# EAGLE design ir_smd (EAGLE 9.6.2)
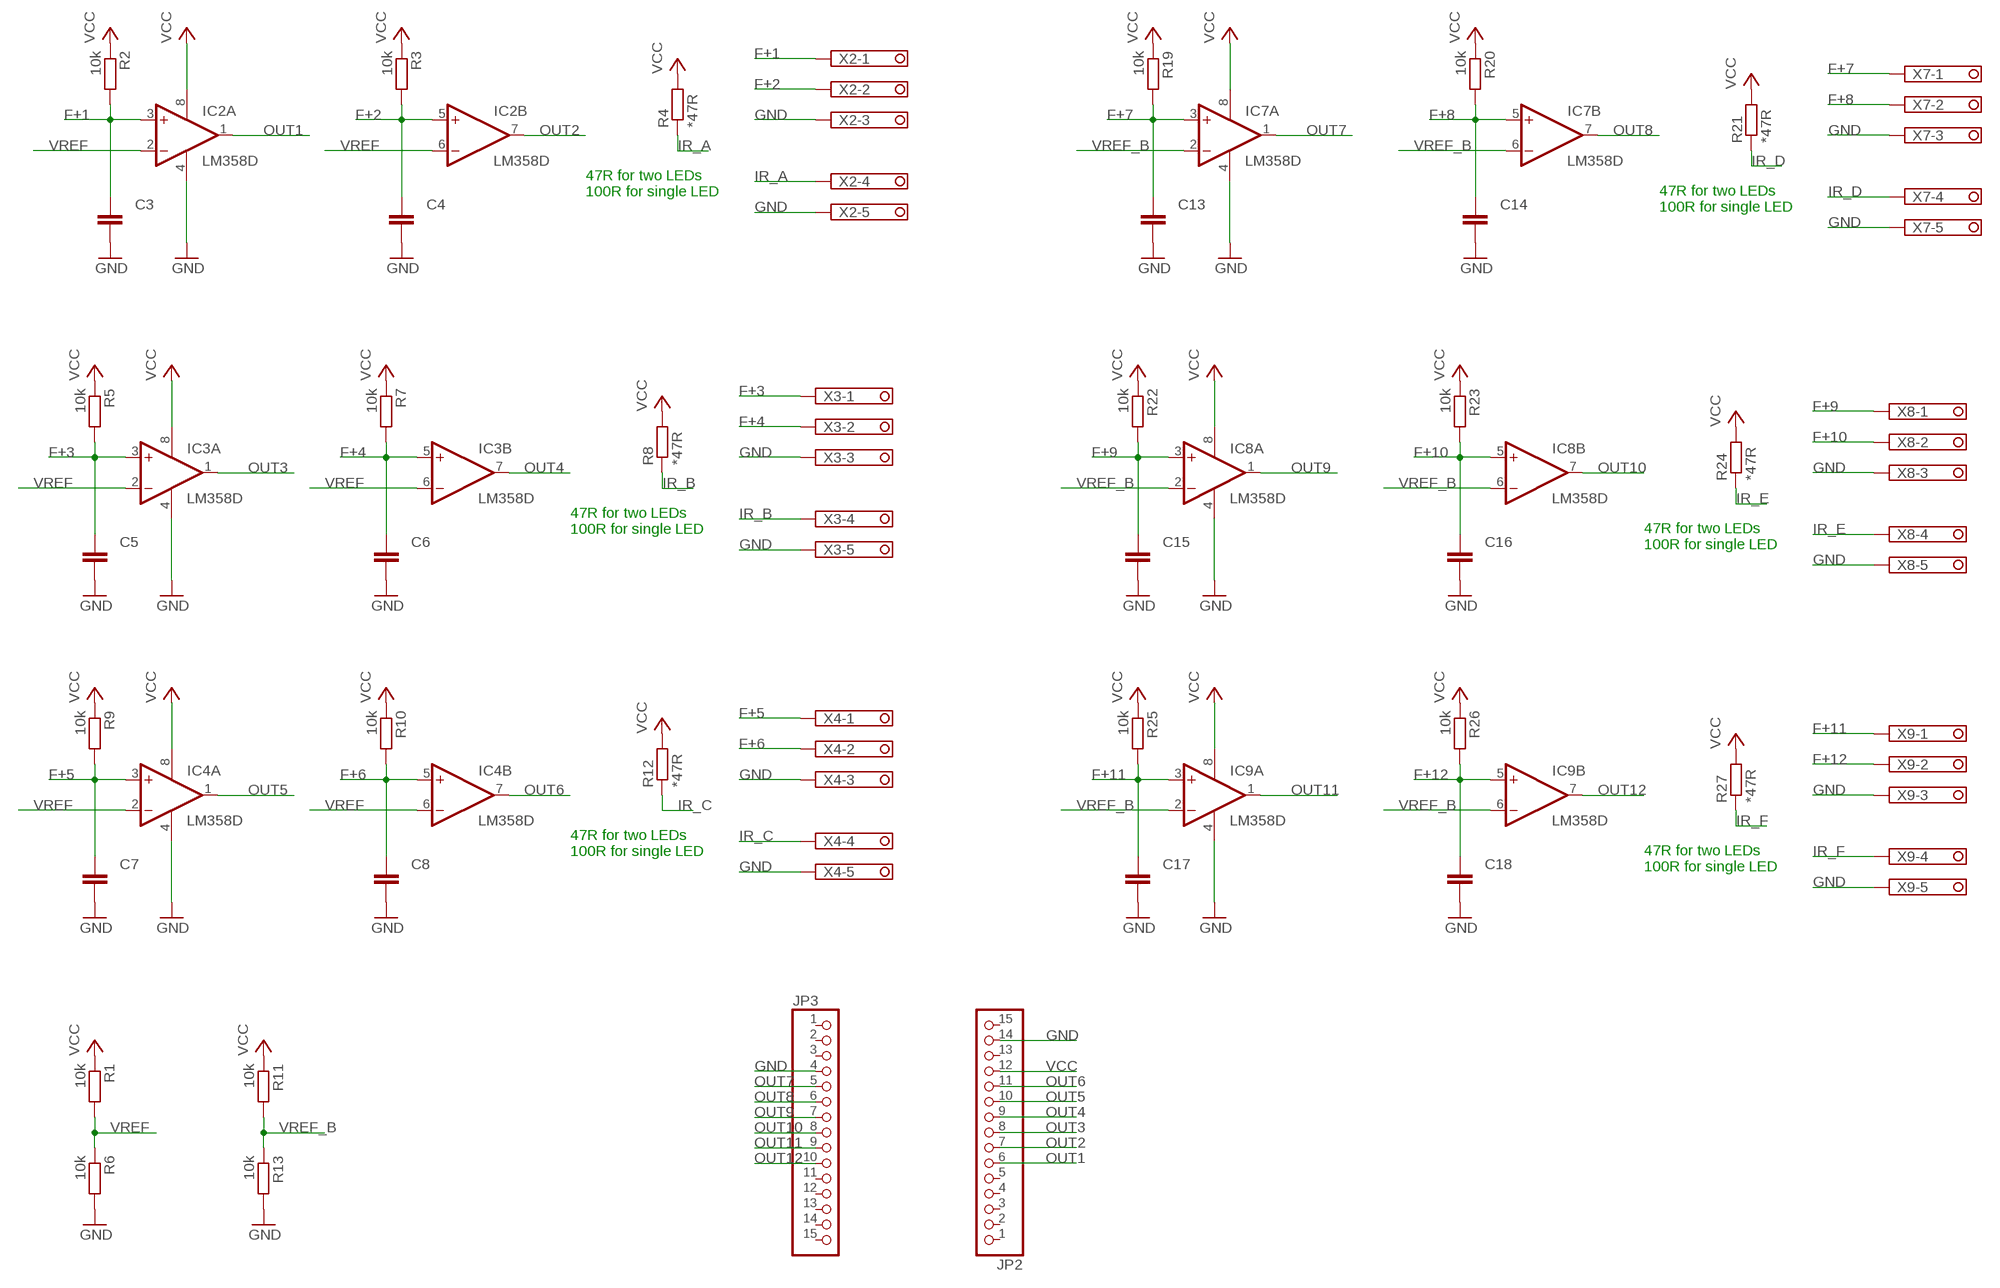
[diagram p0: schematic, sheet 1]

## Parts
C3  C-EUC0603  [C0603]
C4  C-EUC0603  [C0603]
C5  C-EUC0603  [C0603]
C6  C-EUC0603  [C0603]
C7  C-EUC0603  [C0603]
C8  C-EUC0603  [C0603]
C13  C-EUC0603  [C0603]
C14  C-EUC0603  [C0603]
C15  C-EUC0603  [C0603]
C16  C-EUC0603  [C0603]
C17  C-EUC0603  [C0603]
C18  C-EUC0603  [C0603]
IC2  LM358D  [SO08]
IC3  LM358D  [SO08]
IC4  LM358D  [SO08]
IC7  LM358D  [SO08]
IC8  LM358D  [SO08]
IC9  LM358D  [SO08]
JP2  PINHD-1X15  [1X15]
JP3  PINHD-1X15  [1X15]
R1  10k  R-EU_R0805  [R0805]
R2  10k  R-EU_R0805  [R0805]
R3  10k  R-EU_R0805  [R0805]
R4  *47R  R-EU_R0805  [R0805]
R5  10k  R-EU_R0805  [R0805]
R6  10k  R-EU_R0805  [R0805]
R7  10k  R-EU_R0805  [R0805]
R8  *47R  R-EU_R0805  [R0805]
R9  10k  R-EU_R0805  [R0805]
R10  10k  R-EU_R0805  [R0805]
R11  10k  R-EU_R0805  [R0805]
R12  *47R  R-EU_R0805  [R0805]
R13  10k  R-EU_R0805  [R0805]
R19  10k  R-EU_R0805  [R0805]
R20  10k  R-EU_R0805  [R0805]
R21  *47R  R-EU_R0805  [R0805]
R22  10k  R-EU_R0805  [R0805]
R23  10k  R-EU_R0805  [R0805]
R24  *47R  R-EU_R0805  [R0805]
R25  10k  R-EU_R0805  [R0805]
R26  10k  R-EU_R0805  [R0805]
R27  *47R  R-EU_R0805  [R0805]
X2  1751277  [1751277]
X3  1751277  [1751277]
X4  1751277  [1751277]
X7  1751277  [1751277]
X8  1751277  [1751277]
X9  1751277  [1751277]

## Nets
F+1: C3.1 IC2.3(A:+IN) R2.2 X2.1
F+2: C4.1 IC2.5(B:+IN) R3.2 X2.2
F+3: C5.1 IC3.3(A:+IN) R5.2 X3.1
F+4: C6.1 IC3.5(B:+IN) R7.2 X3.2
F+5: C7.1 IC4.3(A:+IN) R9.2 X4.1
F+6: C8.1 IC4.5(B:+IN) R10.2 X4.2
F+7: C13.1 IC7.3(A:+IN) R19.2 X7.1
F+8: C14.1 IC7.5(B:+IN) R20.2 X7.2
F+9: C15.1 IC8.3(A:+IN) R22.2 X8.1
F+10: C16.1 IC8.5(B:+IN) R23.2 X8.2
F+11: C17.1 IC9.3(A:+IN) R25.2 X9.1
F+12: C18.1 IC9.5(B:+IN) R26.2 X9.2
GND: C3.2 C4.2 C5.2 C6.2 C7.2 C8.2 C13.2 C14.2 C15.2 C16.2 C17.2 C18.2 IC2.4(P:V-) IC3.4(P:V-) IC4.4(P:V-) IC7.4(P:V-) IC8.4(P:V-) IC9.4(P:V-) JP2.14 JP3.4 R6.2 R13.2 X2.3 X2.5 X3.3 X3.5 X4.3 X4.5 X7.3 X7.5 X8.3 X8.5 X9.3 X9.5
IR_A: R4.1 X2.4
IR_B: R8.1 X3.4
IR_C: R12.1 X4.4
IR_D: R21.1 X7.4
IR_E: R24.1 X8.4
IR_F: R27.1 X9.4
OUT1: IC2.1(A:OUT) JP2.6
OUT2: IC2.7(B:OUT) JP2.7
OUT3: IC3.1(A:OUT) JP2.8
OUT4: IC3.7(B:OUT) JP2.9
OUT5: IC4.1(A:OUT) JP2.10
OUT6: IC4.7(B:OUT) JP2.11
OUT7: IC7.1(A:OUT) JP3.5
OUT8: IC7.7(B:OUT) JP3.6
OUT9: IC8.1(A:OUT) JP3.7
OUT10: IC8.7(B:OUT) JP3.8
OUT11: IC9.1(A:OUT) JP3.9
OUT12: IC9.7(B:OUT) JP3.10
VCC: IC2.8(P:V+) IC3.8(P:V+) IC4.8(P:V+) IC7.8(P:V+) IC8.8(P:V+) IC9.8(P:V+) JP2.12 R1.1 R2.1 R3.1 R4.2 R5.1 R7.1 R8.2 R9.1 R10.1 R11.1 R12.2 R19.1 R20.1 R21.2 R22.1 R23.1 R24.2 R25.1 R26.1 R27.2
VREF: IC2.2(A:-IN) IC2.6(B:-IN) IC3.2(A:-IN) IC3.6(B:-IN) IC4.2(A:-IN) IC4.6(B:-IN) R1.2 R6.1
VREF_B: IC7.2(A:-IN) IC7.6(B:-IN) IC8.2(A:-IN) IC8.6(B:-IN) IC9.2(A:-IN) IC9.6(B:-IN) R11.2 R13.1
Unconnected: JP2.1 JP2.2 JP2.3 JP2.4 JP2.5 JP2.13 JP2.15 JP3.1 JP3.2 JP3.3 JP3.11 JP3.12 JP3.13 JP3.14 JP3.15

## Notes on the sheet
- 47R for two LEDs
  100R for single LED
- 47R for two LEDs
  100R for single LED
- 47R for two LEDs
  100R for single LED
- 47R for two LEDs
  100R for single LED
- 47R for two LEDs
  100R for single LED
- 47R for two LEDs
  100R for single LED

## Library data of the parts
C3-C8 C13-C18 = rcl:C-EU: CAPACITOR, European symbol; SPICEPREFIX: C
IC2-IC4 IC7-IC9 = linear:LM358: OP AMP also LM158; LM258; LM2904 Source: http://cache.national.com/ds/LM/LM158.pdf
JP2 JP3 = pinhead:PINHD-1X15: PIN HEADER
R1-R13 R19-R27 = rcl:R-EU_: RESISTOR, European symbol; SPICEPREFIX: R
X2-X4 X7-X9 = con-phoenix-350:1751277: MKDS 1/ 5-3,5 Printklemme Nennstrom: 10 A Bemessungsspannung: 160 V Raster: 3,5 mm Polzahl: 5 Montageart: Löten Anschlussart: Schraubanschluss Anschlussrichtung vom Leiter zur Platine: 0° Source: http://eshop.phoenixcontact.com .. 1751277.pdf; OC_FARNELL: unknown; OC_NEWARK: unknown

## Board
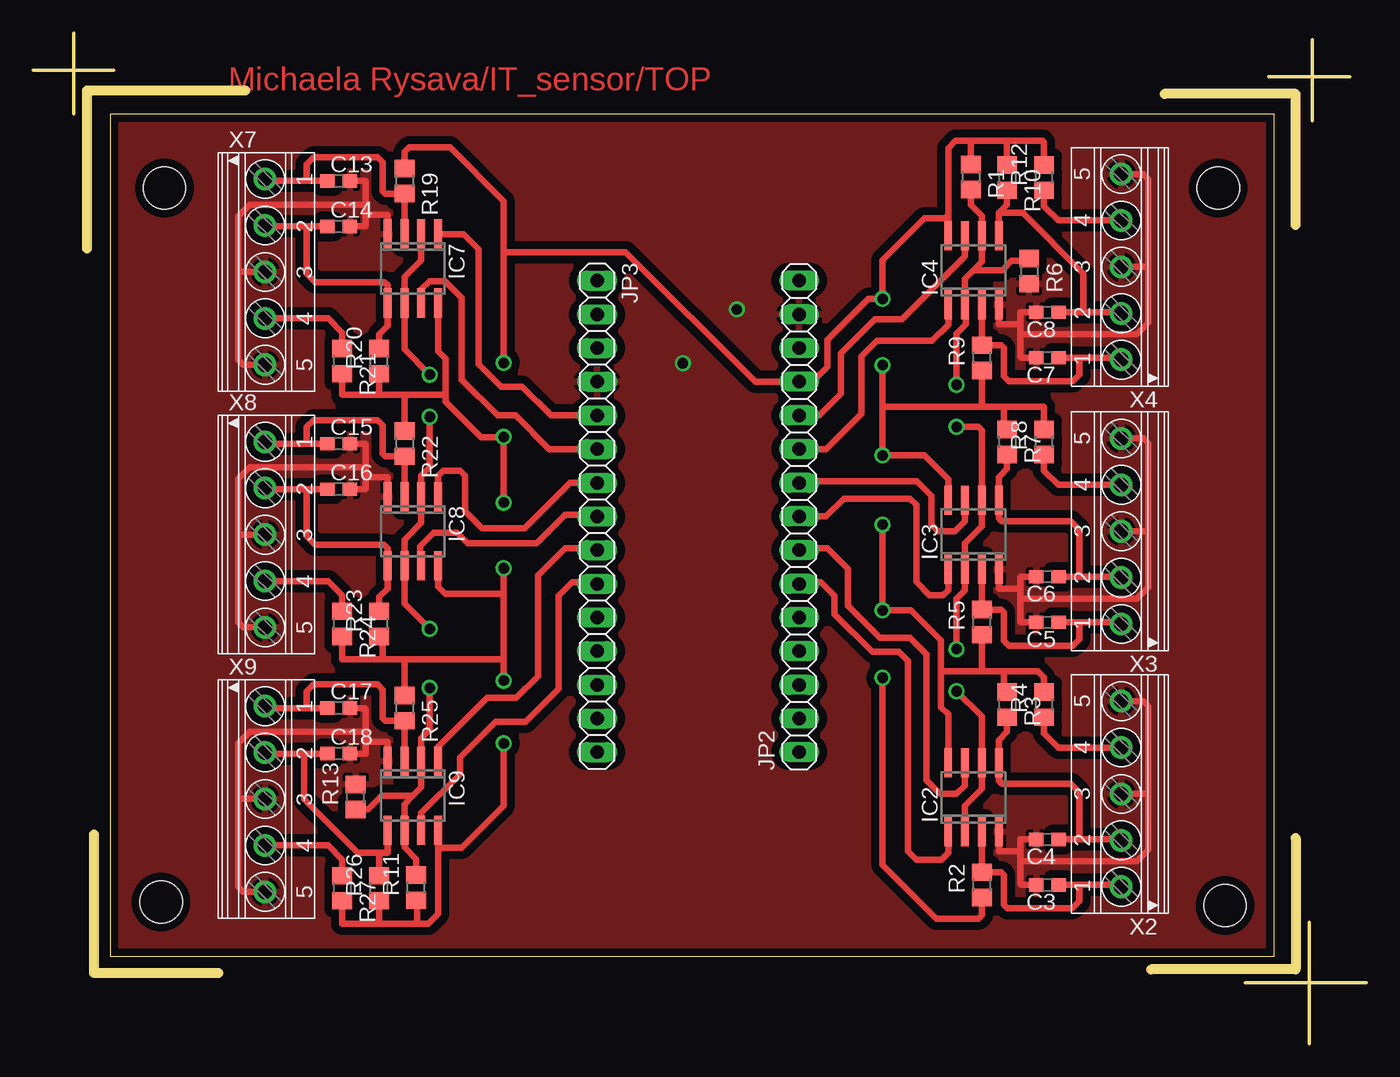
[diagram p1: board, top side]
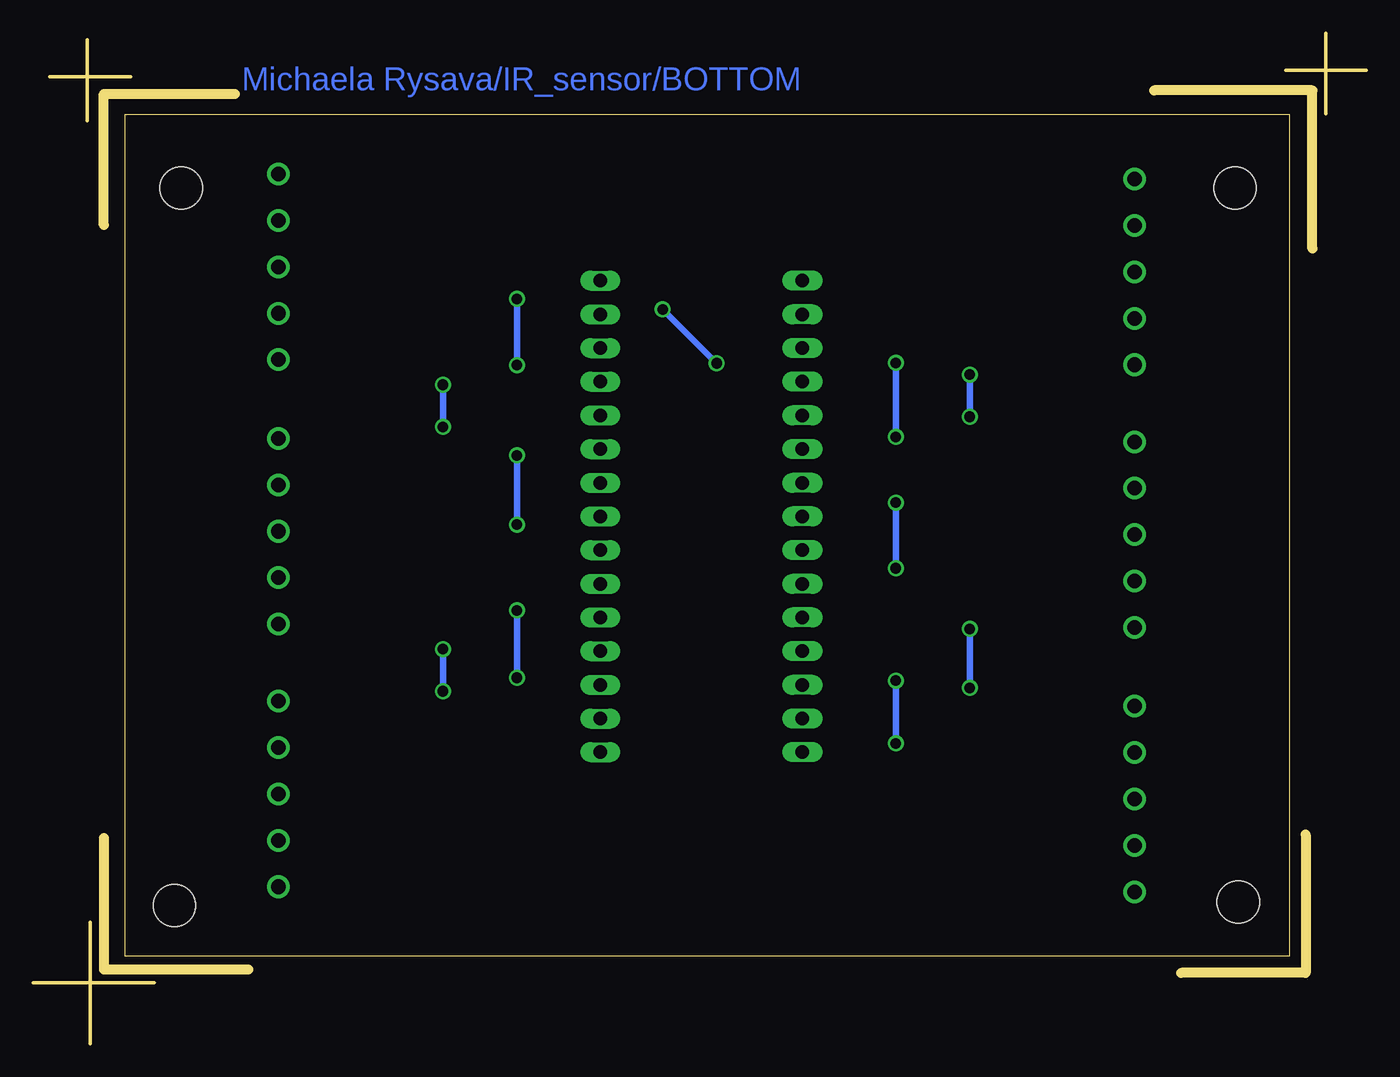
[diagram p2: board, bottom side, seen from below]

Size 100.58 x 76.2 mm. Coordinates in mm from the lower left corner, seen from the top.
Outline: 95.25,61.72 95.25,71.63 85.34,71.63
Outline: 95.25,15.49 95.25,5.59 84.33,5.59
Outline: 4.57,15.75 4.57,5.33 13.97,5.33
Outline: 4.06,59.94 4.06,71.88 16,71.88
Outline: 96.52,69.6 96.52,75.69
Outline: 93.22,72.9 99.31,72.9
Outline: 3.05,70.1 3.05,76.2
Outline: 6.1,73.41 0,73.41
Outline: 91.44,4.57 100.58,4.57
Outline: 96.27,9.14 96.27,0
Outline: 5.81,6.6 93.65,6.6 93.65,70.1 5.81,70.1 5.81,6.6
Copper layers (1*16): Top 0.035mm / dielectric 1.5mm / Bottom 0.035mm
Design rules "UREL_03mm": minimum track width 0.3mm, minimum drill 0.6mm, track to track 0.3mm, track to pad 0.3mm, pad to pad 0.3mm, via to via 0.3mm, smd to smd 0.3mm, copper to edge 0.5mm, drill to drill 0.5mm, minimum pad ring 10mil, minimum via ring 8mil, stop-mask expansion 4mil, vias tented up to drill 0mil, thermal gap 10mil
Holes 3.2 mm at 9.91,64.52 89.41,64.52 89.92,10.41 9.65,10.67

### Footprints (pad centres in the part's own frame; a part is rotated, then mirrored left to right if it is on the bottom)
C0603 = smd 1.1 x 1: 1 -0.85,0; 2 0.85,0
SO08 = smd 0.6 x 2.2: 1 -1.905,-2.6; 2 -0.635,-2.6; 3 0.635,-2.6; 4 1.905,-2.6; 5 1.905,2.6; 6 0.635,2.6; 7 -0.635,2.6; 8 -1.905,2.6
1X15 = drill 1.016 long: 1 -17.78,0; 2 -15.24,0; 3 -12.7,0; 4 -10.16,0; 5 -7.62,0; 6 -5.08,0; 7 -2.54,0; 8 0,0; 9 2.54,0; 10 5.08,0; 11 7.62,0; 12 10.16,0; 13 12.7,0; 14 15.24,0; 15 17.78,0
R0805 = smd 1.3 x 1.5: 1 -0.95,0; 2 0.95,0
1751277 = drill 1.1 pad 1.7: 1 -7,-0.1; 2 -3.5,-0.1; 3 0,-0.1; 4 3.5,-0.1; 5 7,-0.1

### Placement (x,y rotation side)
C3  76.53,11.96 180 top
C4  76.53,15.39 180 top
C5  76.53,31.78 180 top
C6  76.53,35.21 180 top
C7  76.53,51.72 180 top
C8  76.53,55.15 180 top
C13  23.06,65.05 0 top
C14  23.06,61.62 0 top
C15  23.06,45.24 0 top
C16  23.06,41.81 0 top
C17  23.06,25.3 0 top
C18  23.06,21.87 0 top
IC2  70.94,18.57 0 top
IC3  70.94,38.38 0 top
IC4  70.94,58.32 0 top
IC7  28.65,58.45 180 top
IC8  28.65,38.63 180 top
IC9  28.65,18.7 180 top
JP2  57.78,39.75 90 top
JP3  42.55,39.75 270 top
R1  70.74,65.35 270 top
R2  71.57,11.96 90 top
R3  73.48,25.55 270 top
R4  76.27,25.55 90 top
R5  71.57,31.78 90 top
R6  75.14,58.25 270 top
R7  73.48,45.37 270 top
R8  76.27,45.37 90 top
R9  71.57,51.72 90 top
R10  73.48,65.3 270 top
R11  28.89,11.76 90 top
R12  76.27,65.3 90 top
R13  24.32,18.59 90 top
R19  28.01,65.05 270 top
R20  26.11,51.46 90 top
R21  23.31,51.46 270 top
R22  28.01,45.24 270 top
R23  26.11,31.65 90 top
R24  23.31,31.65 270 top
R25  28.01,25.3 270 top
R26  26.11,11.71 90 top
R27  23.31,11.71 270 top
X2  81.99,18.82 90 top
X3  81.99,38.63 90 top
X4  81.99,58.57 90 top
X7  17.6,58.19 270 top
X8  17.6,38.38 270 top
X9  17.6,18.44 270 top

### Tracks (layer width: path | path; a pad name or v marks a point on that pad's centre or on a via)
F+1
  Top 0.508: C3.1 78.94,11.96 | 78.94,11.96 81.95,11.96 X2.1 | IC2.3 R2.2 73.04,12.91 73.23,12.73 73.23,10.47 73.51,10.19 78.39,10.19 78.94,10.74 78.94,11.96
F+2
  Top 0.508: R3.2 73.48,23.52 72.84,22.89 IC2.5 72.84,19.84 73.1,19.59 78.31,19.59 78.94,18.95 78.94,15.39 | C4.1 78.94,15.39 | 78.94,15.39 82.02,15.39 X2.2
F+3
  Top 0.508: C5.1 78.94,31.78 | 78.94,31.78 81.95,31.78 X3.1 | 78.94,31.78 78.94,30.51 78.43,30 73.61,30 73.23,30.38 73.23,32.54 73.04,32.73 R5.2 IC3.3
F+4
  Top 0.508: R7.2 73.48,43.33 72.84,42.7 IC3.5 72.84,39.65 73.1,39.4 78.31,39.4 78.94,38.76 78.94,35.21 | C6.1 78.94,35.21 | 78.94,35.21 82.02,35.21 X3.2
F+5
  Top 0.508: C7.1 78.94,51.72 | 78.94,51.72 81.95,51.72 X4.1 | 78.94,51.72 78.94,50.45 78.43,49.94 73.61,49.94 73.23,50.32 73.23,52.48 73.04,52.67 R9.2 IC4.3
F+6
  Top 0.508: R10.2 73.48,63.27 72.84,62.64 | C8.1 79.24,55.15 | 79.24,55.15 82.02,55.15 X4.2 | 79.24,55.15 79.24,58.07 74.67,62.64 72.84,62.64 | IC4.5 72.84,62.64
F+7
  Top 0.508: C13.1 20.65,65.05 | 20.65,65.05 17.64,65.05 X7.1 | 20.65,65.05 20.65,66.32 21.15,66.83 25.98,66.83 26.36,66.45 26.36,64.29 26.55,64.1 R19.2 IC7.3
F+8
  Top 0.508: R20.2 26.11,53.49 26.74,54.13 IC7.5 26.74,57.18 26.49,57.43 21.28,57.43 20.65,58.07 20.65,61.62 | C14.1 20.65,61.62 | 20.65,61.62 17.57,61.62 X7.2
F+9
  Top 0.508: C15.1 20.65,45.24 | 20.65,45.24 17.64,45.24 X8.1 | 20.65,45.24 20.65,46.51 21.15,47.02 25.98,47.02 26.36,46.64 26.36,44.48 26.55,44.29 R22.2 IC8.3
F+10
  Top 0.508: R23.2 26.11,33.68 26.74,34.32 IC8.5 26.74,37.37 26.49,37.62 21.28,37.62 20.65,38.25 20.65,41.81 | C16.1 20.65,41.81 | 20.65,41.81 17.57,41.81 X8.2
F+11
  Top 0.508: C17.1 20.65,25.3 | 20.65,25.3 17.64,25.3 X9.1 | 20.65,25.3 20.65,26.57 21.15,27.08 25.98,27.08 26.36,26.7 26.36,24.54 26.55,24.35 R25.2 IC9.3
F+12
  Top 0.508: IC9.5 26.74,14.38 26.04,14.38 | C18.1 20.45,21.87 | 20.45,21.87 17.57,21.87 X9.2 | 20.45,21.87 20.45,18.41 24.48,14.38 26.04,14.38 | 26.04,14.38 26.11,14.3 R26.2
GND  (via drill 0.8)
  Top 0.508: IC2.4 72.84,14.5 74.5,14.5 | C4.2 74.5,15.39 74.5,14.5 | 74.5,14.5 74.5,13.74 | C3.2 74.53,11.96 74.5,12 74.5,13.74 | 84.13,18.82 84.13,14.61 83.26,13.74 74.5,13.74 | X2.5 83.75,25.82 84.13,25.45 84.13,18.82 | 84.13,18.82 X2.3 | IC3.4 72.84,34.32 74.5,34.32 | C6.2 74.5,35.21 74.5,34.32 | 74.5,34.32 74.5,33.55 | C5.2 74.53,31.78 74.5,31.82 74.5,33.55 | 84.13,38.63 84.13,34.43 83.26,33.55 74.5,33.55 | X3.5 83.75,45.63 84.13,45.26 84.13,38.63 | 84.13,38.63 X3.3 | IC4.4 72.84,54.26 74.5,54.26 | C8.2 74.5,55.15 74.5,54.26 | 74.5,54.26 74.5,53.49 | C7.2 74.53,51.72 74.5,51.76 74.5,53.49 | 84.13,58.57 84.13,54.37 83.26,53.49 74.5,53.49 | X4.5 83.75,65.57 84.13,65.2 84.13,58.57 | 84.13,58.57 X4.3 | IC7.4 26.74,62.51 25.09,62.51 | C14.2 25.09,61.62 25.09,62.51 | 25.09,62.51 25.09,63.27 | C13.2 25.05,65.05 25.09,65.01 25.09,63.27 | 15.46,58.19 15.46,62.4 16.33,63.27 25.09,63.27 | X7.5 15.84,51.19 15.46,51.57 15.46,58.19 | 15.46,58.19 X7.3 | IC8.4 26.74,42.7 25.09,42.7 | C16.2 25.09,41.81 25.09,42.7 | 25.09,42.7 25.09,43.46 | C15.2 25.05,45.24 25.09,45.2 25.09,43.46 | 15.46,38.38 15.46,42.59 16.33,43.46 25.09,43.46 | X8.5 15.84,31.38 15.46,31.76 15.46,38.38 | 15.46,38.38 X8.3 | IC9.4 26.74,22.76 25.09,22.76 | C18.2 25.09,21.87 25.09,22.76 | 25.09,22.76 25.09,23.52 | C17.2 25.05,25.3 25.09,25.26 25.09,23.52 | 15.46,18.44 15.46,22.65 16.33,23.52 25.09,23.52 | X9.5 15.84,11.44 15.46,11.82 15.46,18.44 | 15.46,18.44 X9.3
  Bottom 0.508: v49.02,51.31 v53.09,55.37
  pour Top (isolate 0.6): 5.68,6.73 93.91,6.73 93.91,70.35 5.68,70.35
IR_A
  Top 0.508: X2.4 77.35,22.32 76.27,23.4 R4.1
IR_B
  Top 0.508: X3.4 77.35,42.13 76.27,43.21 R8.1
IR_C
  Top 0.508: X4.4 77.35,62.07 76.27,63.15 R12.1
IR_D
  Top 0.508: X7.4 22.24,54.69 23.31,53.62 R21.1
IR_E
  Top 0.508: X8.4 22.24,34.88 23.31,33.81 R24.1
IR_F
  Top 0.508: X9.4 22.24,14.94 23.31,13.87 R27.1
OUT1
  Top 0.508: IC2.1 69.03,14.38 68.53,13.87 66.62,13.87 65.99,14.5 65.99,28.86 65.31,29.53 63.31,29.53 60.45,32.39 60.45,33.78 59.44,34.8 57.91,34.8 JP2.6
OUT2
  Top 0.508: IC2.7 70.3,19.46 69.67,18.82 68.4,18.82 67.38,19.84 67.38,29.36 66.15,30.59 63.9,30.59 61.47,33.02 61.47,35.81 59.94,37.34 57.91,37.34 JP2.7
OUT3
  Top 0.508: IC3.1 69.03,34.19 68.65,33.81 67.64,33.81 66.62,34.83 66.62,40.62 66.15,41.09 61.15,41.09 59.82,39.75 JP2.8
OUT4
  Top 0.508: IC3.7 70.3,39.4 69.54,38.63 68.27,38.63 67.76,39.14 67.76,41.3 66.66,42.4 57.9,42.4 JP2.9
OUT5
  Top 0.508: IC4.1 69.03,54.2 67.82,52.99 63.64,52.99 62.48,51.83 62.48,47.5 59.82,44.83 JP2.10
OUT6
  Top 0.508: IC4.7 70.3,59.37 65.55,54.61 63.5,54.61 60.96,52.07 60.96,49.02 59.31,47.37 JP2.11
OUT7
  Top 0.508: IC7.1 32.46,61.05 33.6,59.9 33.6,51.24 35.31,49.53 36.9,49.53 39.06,47.37 JP3.5
OUT8
  Top 0.508: IC7.7 29.28,56.89 29.9,57.5 31.08,57.5 32.33,56.25 32.33,50.07 35.02,47.37 36.39,47.37 38.93,44.83 JP3.6
OUT9
  Top 0.508: IC8.1 30.55,42.83 30.93,43.21 32.2,43.21 32.59,42.83 32.59,40.16 33.88,38.86 37.08,38.86 40.51,42.29 JP3.7
OUT10
  Top 0.508: IC8.7 29.2,36.11 29.2,37.49 30.22,38.51 32,38.51 32.79,37.72 37.97,37.72 40.13,39.88 42.42,39.88 JP3.8
OUT11
  Top 0.508: IC9.1 30.55,22.38 34.24,26.06 36.45,26.06 38.1,27.71 38.1,35.31 40.13,37.34 42.42,37.34 JP3.9
OUT12
  Top 0.508: IC9.7 29.28,17.39 32.2,20.31 32.2,21.59 34.9,24.28 37.16,24.28 39.62,26.75 39.62,33.78 40.64,34.8 42.42,34.8 JP3.10
VCC  (via drill 0.8)
  Top 0.508: R3.1 73.23,26.76 73.23,28.09 | R8.2 76.27,48.03 73.23,48.03 | R7.1 73.23,46.57 73.23,48.03 | R12.2 76.27,67.97 76.17,68.07 73.48,68.07 | 71.57,48.03 73.23,48.03 | 71.57,28.09 73.23,28.09 | R9.1 71.57,48.03 | R5.1 71.57,28.09 | R10.1 73.48,68.07 | 73.48,68.07 70.74,68.07 | 70.74,68.07 69.57,68.07 69.03,67.53 69.03,62.51 | 69.03,62.51 IC4.8 | 69.03,62.51 68.78,62.26 67.26,62.26 64.08,59.08 v64.08,56.16 63.02,56.16 59.94,53.09 59.94,51.05 58.8,49.91 JP2.12 54.48,49.91 44.7,59.69 35.51,59.69 | v64.08,51.17 64.08,48.03 | 64.08,48.03 v64.08,44.35 67.26,44.35 69.03,42.57 IC3.8 | 71.57,48.03 64.08,48.03 | v64.08,39.14 v64.08,32.67 66.24,32.67 68.48,30.42 68.48,28.09 | IC2.8 69.03,24.82 68.48,25.37 68.48,28.09 | 71.57,28.09 68.48,28.09 | R2.1 71.57,9.68 71.32,9.43 68.15,9.43 64.08,13.49 v64.08,27.59 | R21.2 23.31,48.92 25.98,48.92 | R24.2 23.31,28.98 26.36,28.98 | R23.1 26.36,30.45 26.36,28.98 | R27.2 23.31,9.04 26.11,9.04 | 28.01,28.98 26.36,28.98 | 28.01,48.92 25.98,48.92 | R25.1 28.01,28.98 | R22.1 28.01,48.92 | R26.1 26.11,9.04 | 26.11,9.04 28.96,9.04 | 28.96,9.04 29.79,9.04 30.55,9.81 30.55,14.5 | 30.55,14.5 IC9.8 | 30.55,14.5 30.81,14.76 32.33,14.76 35.51,17.93 v35.51,22.63 | v35.51,27.37 35.51,28.98 | 35.51,28.98 35.51,33.94 | 35.51,33.94 v35.51,35.84 | 28.01,28.98 35.51,28.98 | v35.51,40.79 v35.51,45.75 35.48,45.72 33.78,45.72 31.1,48.4 31.1,48.92 | IC7.8 30.55,52.2 31.1,51.65 31.1,48.92 | 28.01,48.92 31.1,48.92 | v35.51,51.34 35.51,59.69 | 35.51,59.69 35.51,63.53 31.44,67.59 28.35,67.59 28.01,67.26 R19.1 | IC8.8 30.55,34.44 31.06,33.94 35.51,33.94 | R1.1 70.74,68.07 | R11.1 28.96,10.74 28.96,9.04 | R20.1 26.11,49.05 25.98,48.92
  Top 0.508: 73.23,28.09 75.79,28.09 76.27,27.61 R4.2
  Bottom 0.508: v64.08,56.16 v64.08,51.17 | v64.08,44.35 v64.08,39.14 | v64.08,32.67 v64.08,27.59 | v35.51,22.63 v35.51,27.37 | v35.51,35.84 v35.51,40.79 | v35.51,45.75 v35.51,51.34
VREF  (via drill 0.8)
  Top 0.508: 70.96,58.34 71.57,58.95 IC4.6 71.57,62.42 70.74,63.25 R1.2 | 70.96,58.34 70.3,57.69 IC4.2 70.36,55.67 70.36,54.23 69.67,53.54 v69.67,49.68 | v69.67,46.51 71.32,46.51 71.57,46.26 IC3.6 71.57,39.02 70.3,37.75 IC3.2 70.3,34.19 69.67,33.55 v69.67,29.74 | IC2.2 70.3,17.93 71.57,19.2 IC2.6 71.57,24.66 v69.67,26.57 | 70.96,58.34 73.12,58.34 73.81,59.02 74.96,59.02 R6.1
  Bottom 0.508: v69.67,49.68 v69.67,46.51 | v69.67,29.74 v69.67,26.57
VREF_B  (via drill 0.8)
  Top 0.508: v29.92,26.82 29.92,23.65 29.28,23.01 IC9.2 29.28,19.33 28.6,18.65 | 28.6,18.65 28.01,18.06 IC9.6 28.01,14.79 28.89,13.91 R11.2 | R13.1 24.33,17.65 25.27,17.65 26.29,18.67 28.57,18.67 28.6,18.65 | IC7.2 29.28,59.08 28.01,57.81 IC7.6 28.01,52.35 v29.92,50.45 | v29.92,47.27 29.92,43.46 29.28,42.83 IC8.2 29.28,39.27 28.01,38 IC8.6 28.01,33.17 v29.92,31.27
  Bottom 0.508: v29.92,47.27 v29.92,50.45 | v29.92,26.82 v29.92,31.27

### Text on the board
Top: Michaela Rysava/IT_sensor/TOP
Bottom: Michaela Rysava/IR_sensor/BOTTOM